# EasyEDA schematic main_board_schematic.json
TITLE: Sheet_1; REV: 1.0; Date: 2021-07-18; Sheet: 1/1; Drawn By: Gustavo Moraes; Company: Your Company
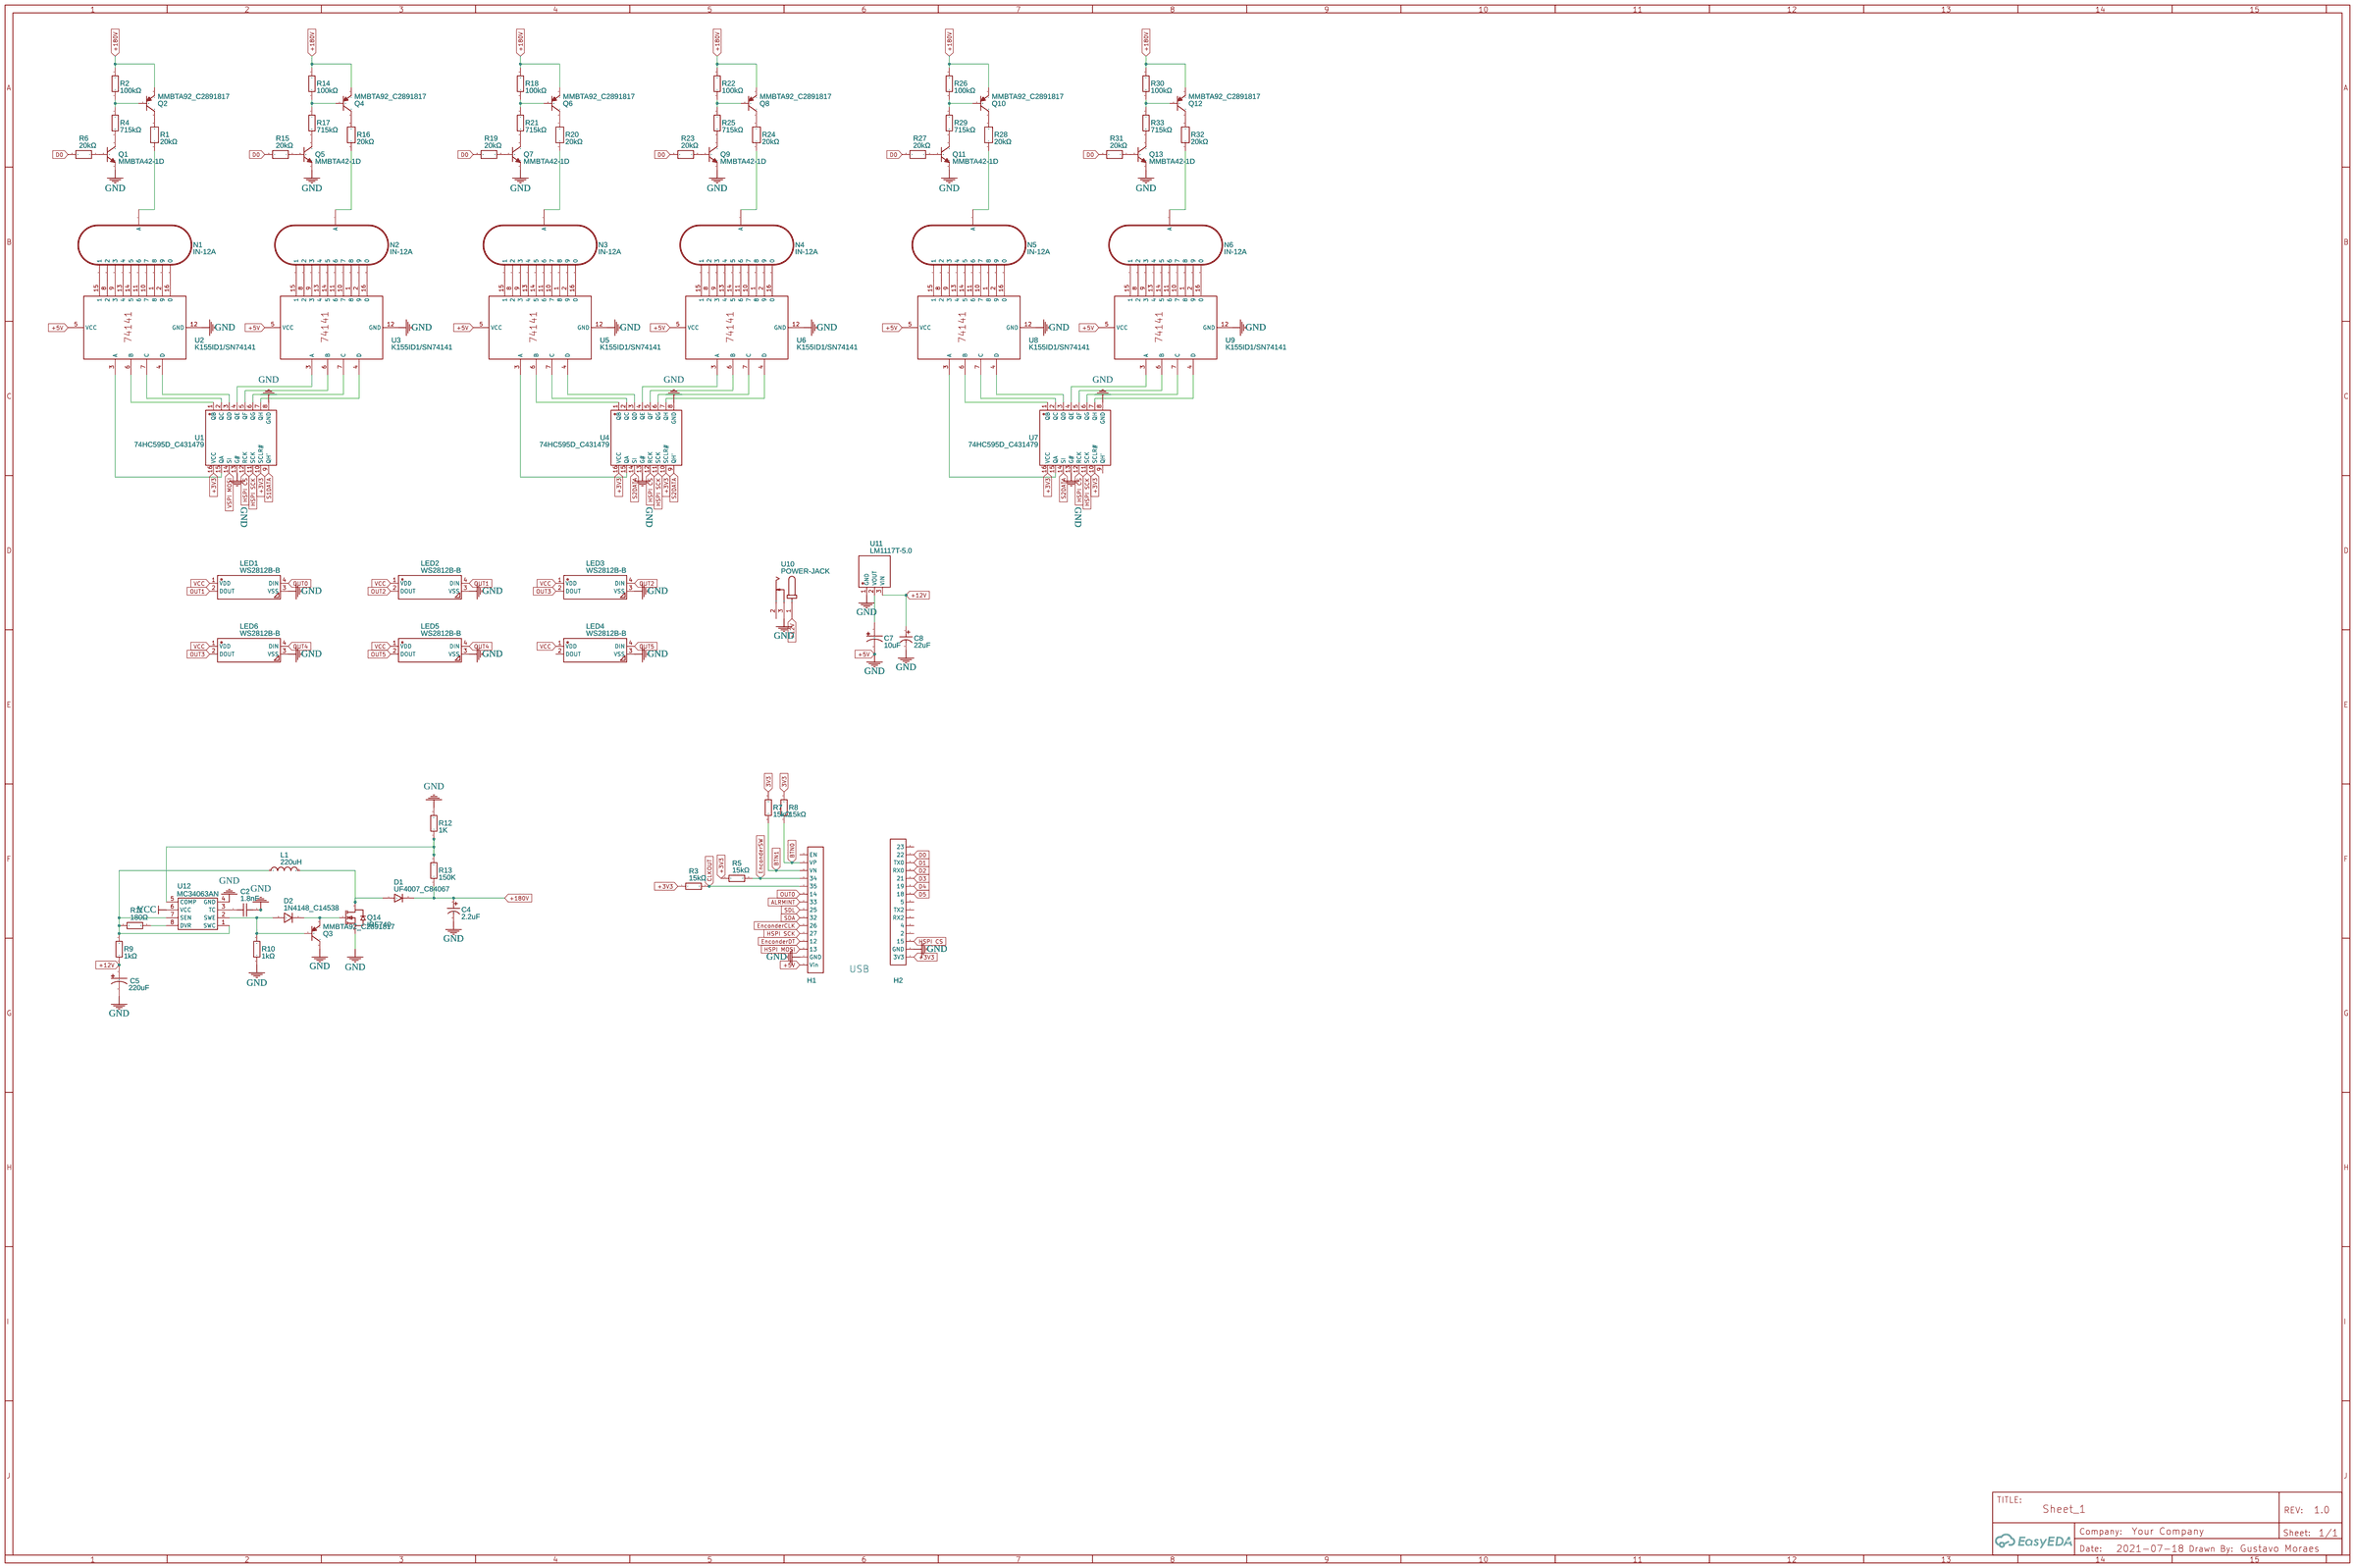
[diagram p0: schematic sheet]

## Parts
C2  1.8nF  [C1206]
C4  2.2uF  [CAP-SMD_BD6.3-L6.6-W6.6-LS7.2-FD]
C5  220uF  [CAP-SMD_BD8.0-L8.3-W8.3-FD]
C7  10uF  [CAP-SMD_BD3.0-L3.3-W3.3-RD]
C8  22uF  [CAP-SMD_BD4.0-L4.3-W4.3-LS5.3-FD]
D1  UF4007_C84067  [DO-41_BD2.4-L4.7-P8.70-D0.9-FD]
D2  1N4148_C14538  [DO-35_BD2.0-L4.2-P8.20-D0.5-RD]
H1  HDR-F-2.54_1x15  [HDR-F-2.54_1X15]
H2  HDR-F-2.54_1x15  [HDR-F-2.54_1X15]
L1  220uH  [IND-SMD_L12.0-W12.0]
LED1  WS2812B-B  [LED-SMD_4P-L5.0-W5.0-TL_WS2812B-B]
LED2  WS2812B-B  [LED-SMD_4P-L5.0-W5.0-TL_WS2812B-B]
LED3  WS2812B-B  [LED-SMD_4P-L5.0-W5.0-TL_WS2812B-B]
LED4  WS2812B-B  [LED-SMD_4P-L5.0-W5.0-TL_WS2812B-B]
LED5  WS2812B-B  [LED-SMD_4P-L5.0-W5.0-TL_WS2812B-B]
LED6  WS2812B-B  [LED-SMD_4P-L5.0-W5.0-TL_WS2812B-B]
N1  IN-12A  [IN-12]
N2  IN-12A  [IN-12]
N3  IN-12A  [IN-12]
N4  IN-12A  [IN-12]
N5  IN-12A  [IN-12]
N6  IN-12A  [IN-12]
Q1  MMBTA42-1D  [SOT-23-3_L2.9-W1.3-P1.90-LS2.4-BR]
Q2  MMBTA92_C2891817  [SOT-23-3_L2.9-W1.3-P1.90-LS2.4-BR]
Q3  MMBTA92_C2891817  [SOT-23-3_L2.9-W1.3-P1.90-LS2.4-BR]
Q4  MMBTA92_C2891817  [SOT-23-3_L2.9-W1.3-P1.90-LS2.4-BR]
Q5  MMBTA42-1D  [SOT-23-3_L2.9-W1.3-P1.90-LS2.4-BR]
Q6  MMBTA92_C2891817  [SOT-23-3_L2.9-W1.3-P1.90-LS2.4-BR]
Q7  MMBTA42-1D  [SOT-23-3_L2.9-W1.3-P1.90-LS2.4-BR]
Q8  MMBTA92_C2891817  [SOT-23-3_L2.9-W1.3-P1.90-LS2.4-BR]
Q9  MMBTA42-1D  [SOT-23-3_L2.9-W1.3-P1.90-LS2.4-BR]
Q10  MMBTA92_C2891817  [SOT-23-3_L2.9-W1.3-P1.90-LS2.4-BR]
Q11  MMBTA42-1D  [SOT-23-3_L2.9-W1.3-P1.90-LS2.4-BR]
Q12  MMBTA92_C2891817  [SOT-23-3_L2.9-W1.3-P1.90-LS2.4-BR]
Q13  MMBTA42-1D  [SOT-23-3_L2.9-W1.3-P1.90-LS2.4-BR]
Q14  IRF740  [TO-220-3_L10.0-W4.5-P2.54-L]
R1  20kΩ  [R0805]
R2  100kΩ  [R0805]
R3  15kΩ  [R0805]
R4  715kΩ  [R1206]
R5  15kΩ  [R0805]
R6  20kΩ  [R0805]
R7  15kΩ  [R0805]
R8  15kΩ  [R0805]
R9  1kΩ  [R1206]
R10  1kΩ  [R1206]
R11  180Ω  [R1206]
R12  1K  [RES-TH_BD2.5-L6.5-P10.50-D0.6]
R13  150K  [RES-TH_BD2.5-L6.5-P10.50-D0.6]
R14  100kΩ  [R0805]
R15  20kΩ  [R0805]
R16  20kΩ  [R0805]
R17  715kΩ  [R1206]
R18  100kΩ  [R0805]
R19  20kΩ  [R0805]
R20  20kΩ  [R0805]
R21  715kΩ  [R1206]
R22  100kΩ  [R0805]
R23  20kΩ  [R0805]
R24  20kΩ  [R0805]
R25  715kΩ  [R1206]
R26  100kΩ  [R0805]
R27  20kΩ  [R0805]
R28  20kΩ  [R0805]
R29  715kΩ  [R1206]
R30  100kΩ  [R0805]
R31  20kΩ  [R0805]
R32  20kΩ  [R0805]
R33  715kΩ  [R1206]
U1  74HC595D_C431479  [SOIC-16_L9.9-W3.9-P1.27-LS6.0-BL]
U2  K155ID1/SN74141  [DIP16]
U3  K155ID1/SN74141  [DIP16]
U4  74HC595D_C431479  [SOIC-16_L9.9-W3.9-P1.27-LS6.0-BL]
U5  K155ID1/SN74141  [DIP16]
U6  K155ID1/SN74141  [DIP16]
U7  74HC595D_C431479  [SOIC-16_L9.9-W3.9-P1.27-LS6.0-BL]
U8  K155ID1/SN74141  [DIP16]
U9  K155ID1/SN74141  [DIP16]
U10  POWER-JACK  [DC-IN-TH_POWER-JACK]
U11  LM1117T-5.0  [TO-220-3_L10.0-W4.5-P2.54-L]
U12  MC34063AN  [DIP-8_L9.8-W6.6-P2.54-LS7.6-BL]

## Library data of the parts
C2 = NV1206B182K102CEDN: Supplier: LCSC; Supplier Part: C2760344; Manufacturer: HUI JU(汇聚); JLCPCB Part Class: Extended Part; Contributor: LCSC
C4 = UD2E2R2M0610: Supplier: LCSC; Manufacturer: HONOR; Supplier Part: C98559; JLCPCB Part Class: Extended Part
C5 = RT1E221M0810: Supplier: LCSC; Supplier Part: C280403; Manufacturer: ROQANG; Contributor: LCSC; JLCPCB Part Class: Extended Part
C7 = UWX1C100MCL2GB: Supplier: LCSC; Supplier Part: C250999; Manufacturer: Nichicon; Contributor: LCSC; JLCPCB Part Class: Extended Part
C8 = RVT1C220M0405: Supplier: LCSC; Manufacturer: ROQANG; Supplier Part: C72502; JLCPCB Part Class: Extended Part
D1 = UF4007_C84067: Supplier: LCSC; Manufacturer: STARSEA; Manufacturer Part: UF4007; Contributor: 立创EDA官方封装库; Supplier Part: C84067; JLCPCB Part Class: Extended Part
D2 = 1N4148_C14538: Supplier: LCSC; Supplier Part: C14538; Manufacturer: Semtech; Manufacturer Part: 1N4148; Contributor: LCSC; JLCPCB Part Class: Extended Part
H1 H2 = HDR-F-2.54_1x15: Supplier Part: C124408; Supplier: LCSC; Contributor: LCEDA_Lib
L1 = SLH1207S221MTT: Supplier: LCSC; Supplier Part: C182174; Manufacturer: Sunltech Tech; Contributor: LCSC; JLCPCB Part Class: Extended Part
LED1-LED6 = WS2812B-B: Supplier: LCSC; Manufacturer: Worldsemi; Contributor: LCSC; Supplier Part: C114586; JLCPCB Part Class: Extended Part
N1-N6 = IN-12A
Q1 Q5 Q7 Q9 Q11 Q13 = MMBTA42-1D: Supplier: LCSC; Supplier Part: C779717; Manufacturer: ZRE; Contributor: LCSC; JLCPCB Part Class: Extended Part
Q2-Q4 Q6 Q8 Q10 Q12 = MMBTA92_C2891817: Supplier: LCSC; Supplier Part: C2891817; Manufacturer: YONGYUTAI(永裕泰); Manufacturer Part: MMBTA92; Contributor: LCSC; JLCPCB Part Class: Extended Part
Q14 = IRF740: Supplier: LCSC; Supplier Part: C358408; Manufacturer: Foshan Blue Rocket Elec; Contributor: LCSC; JLCPCB Part Class: Extended Part
R1 R6 R15 R16 R19 R20 R23 R24 R27 R28 R31 R32 = ERJ6GEYJ203V: Supplier: LCSC; Supplier Part: C413204; Manufacturer: PANASONIC; Resistance (Ohms): 20K; Contributor: LCSC; JLCPCB Part Class: Extended Part
R2 R14 R18 R22 R26 R30 = ERJ6RBD1003V: Supplier: LCSC; Supplier Part: C336855; Manufacturer: PANASONIC; Resistance (Ohms): 100K; Contributor: LCSC; JLCPCB Part Class: Extended Part
R3 R5 R7 R8 = ERJ-6ENF1502V: Supplier: LCSC; Supplier Part: C192065; Manufacturer: PANASONIC; Resistance (Ohms): 15K; Contributor: LCSC; JLCPCB Part Class: Extended Part
R4 R17 R21 R25 R29 R33 = CR1206F715KP05: Supplier: LCSC; Supplier Part: C245593; Manufacturer: Ever Ohms Tech; Resistance (Ohms): 715K; Contributor: LCSC; JLCPCB Part Class: Extended Part
R9 R10 = AECR1206F1K00K9: Supplier: LCSC; Supplier Part: C328410; Manufacturer: ResistorToday; Resistance (Ohms): 1K; Contributor: LCSC; JLCPCB Part Class: Extended Part
R11 = QR1206J180RP05: Supplier: LCSC; Manufacturer: EVER OHMS; Resistance (Ohms): 180; Contributor: LCSC; Supplier Part: C149884; JLCPCB Part Class: Extended Part
R12 = MFR0W4F1001A50: Supplier: LCSC; Manufacturer: UniOhm; Supplier Part: C57435; JLCPCB Part Class: Extended Part; Resistance: 1kΩ
R13 = MFR0W4F1503A50: Supplier: LCSC; Manufacturer: UniOhm; Supplier Part: C58618; JLCPCB Part Class: Extended Part; Resistance: 150kΩ
U1 U4 U7 = 74HC595D_C431479: Supplier: LCSC; Supplier Part: C431479; Manufacturer: TOSHIBA; Manufacturer Part: 74HC595D; Contributor: LCSC; JLCPCB Part Class: Extended Part
U2 U3 U5 U6 U8 U9 = K155ID1/SN74141: Contributor: MarekB
U10 = POWER-JACK: Supplier: LCSC; Supplier Part: C9900001795; Manufacturer: null; JLCPCB Part Class: Extended Part; Contributor: LCSC
U11 = LM1117T-5.0: Supplier: LCSC; Supplier Part: C498320; Manufacturer: HGSEMI; Contributor: LCSC; JLCPCB Part Class: Extended Part
U12 = MC34063AN: Supplier: LCSC; Manufacturer: HTC; Supplier Part: C126078; JLCPCB Part Class: Extended Part

## Nets
3V3: R7.2 R8.2
+3V3: H2.1(3V3) R3.1 R5.1 U1.10(SCLR#) U1.16(VCC) U4.10(SCLR#) U4.16(VCC) U7.10(SCLR#) U7.16(VCC)
+5V: C2.2 C4.2 C5.2 C7.2 C8.2 H1.1(Vin) H1.2(GND) H2.2(GND) LED1.3(VSS) LED2.3(VSS) LED3.3(VSS) LED4.3(VSS) LED5.3(VSS) LED6.3(VSS) Q1.2(E) Q3.3(C) Q5.2(E) Q7.2(E) Q9.2(E) Q11.2(E) Q13.2(E) Q14.3(S) R10.1 R12.2 U1.8(GND) U1.13(G#) U2.5(VCC) U2.12(GND) U3.5(VCC) U3.12(GND) U4.8(GND) U4.13(G#) U5.5(VCC) U5.12(GND) U6.5(VCC) U6.12(GND) U7.8(GND) U7.13(G#) U8.5(VCC) U8.12(GND) U9.5(VCC) U9.12(GND) U10.3 U11.1(GND) U12.4(GND)
+12V: C5.1 C8.1 R9.1 U10.1 U11.3(VIN)
+180V: C4.1 D1.2(C) Q2.2(E) Q4.2(E) Q6.2(E) Q8.2(E) Q10.2(E) Q12.2(E) R2.1 R13.1 R14.1 R18.1 R22.1 R26.1 R30.1
VCC: LED1.1(VDD) LED2.1(VDD) LED3.1(VDD) LED4.1(VDD) LED5.1(VDD) LED6.1(VDD) U12.6(VCC)
ALRMINT: H1.9(33)
BTN0: H1.14(VP) R8.1
BTN1: H1.13(VN) R7.1
CLKOUT: H1.11(35) R3.2
D0: H2.14(22) R6.2 R15.2 R19.2 R23.2 R27.2 R31.2
D1: H2.13(TX0)
D2: H2.12(RX0)
D3: H2.11(21)
D4: H2.10(19)
D5: H2.9(18)
EnconderCLK: H1.6(26)
EnconderDT: H1.4(12)
EnconderSW: H1.12(34) R5.2
HSPI CS: H2.3(15) U1.12(RCK) U4.12(RCK) U7.12(RCK)
HSPI MOSI: H1.3(13)
HSPI SCK: H1.5(27) U1.11(SCK) U4.11(SCK) U7.11(SCK)
OUT0: H1.10(14) LED1.4(DIN)
OUT1: LED1.2(DOUT) LED2.4(DIN)
OUT2: LED2.2(DOUT) LED3.4(DIN)
OUT3: LED3.2(DOUT) LED6.2(DOUT)
OUT4: LED5.4(DIN) LED6.4(DIN)
OUT5: LED4.4(DIN) LED5.2(DOUT)
S1DATA: U1.9(QH')
S2DATA: U4.9(QH') U4.14(SI) U7.14(SI)
SDA: H1.7(32)
SDL: H1.8(25)
VSPI MOSI: U1.14(SI)
Net-(C2-1): C2.1 U12.3(TC)
Net-(C7-1): C7.1 U11.2(VOUT)
Net-(D1-1): D1.1(A) L1.2 Q14.2(D)
Net-(D2-1): D2.1 Q3.2(E) Q14.1(G)
Net-(D2-2): D2.2 Q3.1(B) R10.2 U12.2(SWE)
Net-(L1-1): L1.1 R9.2 R11.1 U12.1(SWC) U12.7(SEN)
Net-(N1-0): N1.0 U2.16(0)
Net-(N1-1): N1.1 U2.15(1)
Net-(N1-2): N1.2 U2.8(2)
Net-(N1-3): N1.3 U2.9(3)
Net-(N1-4): N1.4 U2.13(4)
Net-(N1-5): N1.5 U2.14(5)
Net-(N1-6): N1.6 U2.11(6)
Net-(N1-7): N1.7 U2.10(7)
Net-(N1-8): N1.8 U2.1(8)
Net-(N1-9): N1.9 U2.2(9)
Net-(N1-A): N1.A R1.1
Net-(N2-0): N2.0 U3.16(0)
Net-(N2-1): N2.1 U3.15(1)
Net-(N2-2): N2.2 U3.8(2)
Net-(N2-3): N2.3 U3.9(3)
Net-(N2-4): N2.4 U3.13(4)
Net-(N2-5): N2.5 U3.14(5)
Net-(N2-6): N2.6 U3.11(6)
Net-(N2-7): N2.7 U3.10(7)
Net-(N2-8): N2.8 U3.1(8)
Net-(N2-9): N2.9 U3.2(9)
Net-(N2-A): N2.A R16.1
Net-(N3-0): N3.0 U5.16(0)
Net-(N3-1): N3.1 U5.15(1)
Net-(N3-2): N3.2 U5.8(2)
Net-(N3-3): N3.3 U5.9(3)
Net-(N3-4): N3.4 U5.13(4)
Net-(N3-5): N3.5 U5.14(5)
Net-(N3-6): N3.6 U5.11(6)
Net-(N3-7): N3.7 U5.10(7)
Net-(N3-8): N3.8 U5.1(8)
Net-(N3-9): N3.9 U5.2(9)
Net-(N3-A): N3.A R20.1
Net-(N4-0): N4.0 U6.16(0)
Net-(N4-1): N4.1 U6.15(1)
Net-(N4-2): N4.2 U6.8(2)
Net-(N4-3): N4.3 U6.9(3)
Net-(N4-4): N4.4 U6.13(4)
Net-(N4-5): N4.5 U6.14(5)
Net-(N4-6): N4.6 U6.11(6)
Net-(N4-7): N4.7 U6.10(7)
Net-(N4-8): N4.8 U6.1(8)
Net-(N4-9): N4.9 U6.2(9)
Net-(N4-A): N4.A R24.1
Net-(N5-0): N5.0 U8.16(0)
Net-(N5-1): N5.1 U8.15(1)
Net-(N5-2): N5.2 U8.8(2)
Net-(N5-3): N5.3 U8.9(3)
Net-(N5-4): N5.4 U8.13(4)
Net-(N5-5): N5.5 U8.14(5)
Net-(N5-6): N5.6 U8.11(6)
Net-(N5-7): N5.7 U8.10(7)
Net-(N5-8): N5.8 U8.1(8)
Net-(N5-9): N5.9 U8.2(9)
Net-(N5-A): N5.A R28.1
Net-(N6-0): N6.0 U9.16(0)
Net-(N6-1): N6.1 U9.15(1)
Net-(N6-2): N6.2 U9.8(2)
Net-(N6-3): N6.3 U9.9(3)
Net-(N6-4): N6.4 U9.13(4)
Net-(N6-5): N6.5 U9.14(5)
Net-(N6-6): N6.6 U9.11(6)
Net-(N6-7): N6.7 U9.10(7)
Net-(N6-8): N6.8 U9.1(8)
Net-(N6-9): N6.9 U9.2(9)
Net-(N6-A): N6.A R32.1
Net-(Q1-1): Q1.1(B) R6.1
Net-(Q1-3): Q1.3(C) R4.2
Net-(Q2-1): Q2.1(B) R2.2 R4.1
Net-(Q2-3): Q2.3(C) R1.2
Net-(Q4-1): Q4.1(B) R14.2 R17.1
Net-(Q4-3): Q4.3(C) R16.2
Net-(Q5-1): Q5.1(B) R15.1
Net-(Q5-3): Q5.3(C) R17.2
Net-(Q6-1): Q6.1(B) R18.2 R21.1
Net-(Q6-3): Q6.3(C) R20.2
Net-(Q7-1): Q7.1(B) R19.1
Net-(Q7-3): Q7.3(C) R21.2
Net-(Q8-1): Q8.1(B) R22.2 R25.1
Net-(Q8-3): Q8.3(C) R24.2
Net-(Q9-1): Q9.1(B) R23.1
Net-(Q9-3): Q9.3(C) R25.2
Net-(Q10-1): Q10.1(B) R26.2 R29.1
Net-(Q10-3): Q10.3(C) R28.2
Net-(Q11-1): Q11.1(B) R27.1
Net-(Q11-3): Q11.3(C) R29.2
Net-(Q12-1): Q12.1(B) R30.2 R33.1
Net-(Q12-3): Q12.3(C) R32.2
Net-(Q13-1): Q13.1(B) R31.1
Net-(Q13-3): Q13.3(C) R33.2
Net-(R11-2): R11.2 U12.8(DVR)
Net-(R12-1): R12.1 R13.2 U12.5(COMP)
Net-(U1-1): U1.1(QB) U2.6(B)
Net-(U1-2): U1.2(QC) U2.7(C)
Net-(U1-3): U1.3(QD) U2.4(D)
Net-(U1-4): U1.4(QE) U3.3(A)
Net-(U1-5): U1.5(QF) U3.6(B)
Net-(U1-6): U1.6(QG) U3.7(C)
Net-(U1-7): U1.7(QH) U3.4(D)
Net-(U1-15): U1.15(QA) U2.3(A)
Net-(U4-1): U4.1(QB) U5.6(B)
Net-(U4-2): U4.2(QC) U5.7(C)
Net-(U4-3): U4.3(QD) U5.4(D)
Net-(U4-4): U4.4(QE) U6.3(A)
Net-(U4-5): U4.5(QF) U6.6(B)
Net-(U4-6): U4.6(QG) U6.7(C)
Net-(U4-7): U4.7(QH) U6.4(D)
Net-(U4-15): U4.15(QA) U5.3(A)
Net-(U7-1): U7.1(QB) U8.6(B)
Net-(U7-2): U7.2(QC) U8.7(C)
Net-(U7-3): U7.3(QD) U8.4(D)
Net-(U7-4): U7.4(QE) U9.3(A)
Net-(U7-5): U7.5(QF) U9.6(B)
Net-(U7-6): U7.6(QG) U9.7(C)
Net-(U7-7): U7.7(QH) U9.4(D)
Net-(U7-15): U7.15(QA) U8.3(A)

Not connected (* = marked no-connect by the designer): H1 15(EN); H2 4(2) 5(4) 6(RX2) 7(TX2) 8(5) 15(23); LED4 2(DOUT); U7 9(QH'); U10 2

## Notes on the sheet
- USB
